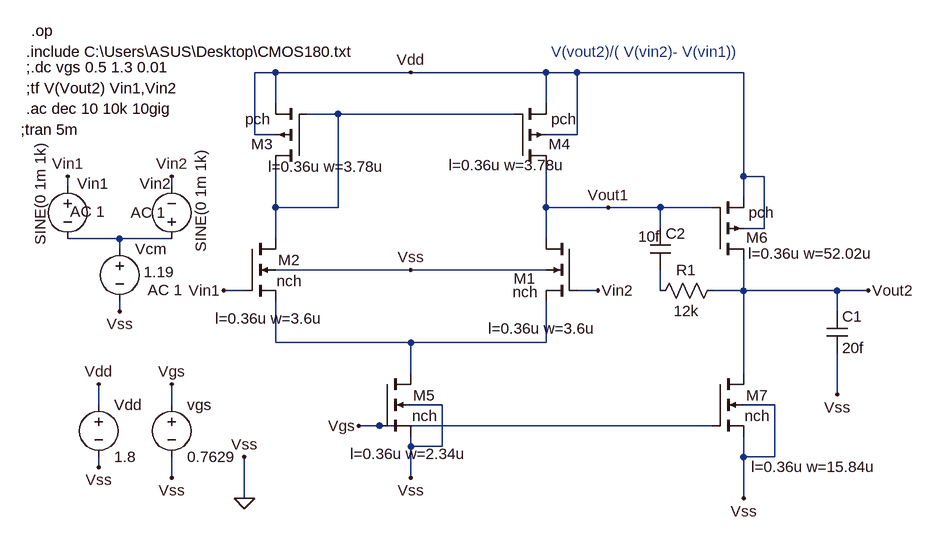
[diagram p0: schematic final design current mirror.asc]
final design current mirror.asc, the LTspice schematic file:
Version 4
SHEET 1 1412 680
WIRE 304 -160 272 -160
WIRE 512 -160 304 -160
WIRE 720 -160 512 -160
WIRE 768 -160 720 -160
WIRE 1024 -160 768 -160
WIRE 304 -112 304 -160
WIRE 720 -112 720 -160
WIRE 400 -96 352 -96
WIRE 672 -96 400 -96
WIRE 272 -64 272 -160
WIRE 304 -64 272 -64
WIRE 768 -64 768 -160
WIRE 768 -64 720 -64
WIRE 1024 0 1024 -160
WIRE 1056 0 1024 0
WIRE -16 16 -16 0
WIRE 144 16 144 0
WIRE 1024 32 1024 0
WIRE 304 48 304 -16
WIRE 400 48 400 -96
WIRE 400 48 304 48
WIRE 720 48 720 -16
WIRE 816 48 720 48
WIRE 896 48 816 48
WIRE 976 48 896 48
WIRE 896 80 896 48
WIRE 1056 80 1056 0
WIRE 1056 80 1024 80
WIRE 64 96 -16 96
WIRE 144 96 64 96
WIRE 304 96 304 48
WIRE 720 96 720 48
WIRE 64 112 64 96
WIRE 512 144 304 144
WIRE 720 144 512 144
WIRE 256 176 224 176
WIRE 800 176 768 176
WIRE 896 176 896 144
WIRE 1024 176 1024 128
WIRE 1024 176 976 176
WIRE 1168 176 1024 176
WIRE 1216 176 1168 176
WIRE 64 208 64 192
WIRE 1168 208 1168 176
WIRE 304 256 304 192
WIRE 512 256 304 256
WIRE 720 256 720 192
WIRE 720 256 512 256
WIRE 512 304 512 256
WIRE 1024 304 1024 176
WIRE 1168 336 1168 272
WIRE 32 352 32 320
WIRE 144 352 144 320
WIRE 560 352 512 352
WIRE 1072 352 1024 352
WIRE 464 384 432 384
WIRE 976 384 464 384
WIRE 512 416 512 400
WIRE 560 416 560 352
WIRE 560 416 512 416
WIRE 1024 432 1024 400
WIRE 1072 432 1072 352
WIRE 1072 432 1024 432
WIRE 32 448 32 432
WIRE 144 464 144 432
WIRE 512 464 512 416
WIRE 256 496 256 432
WIRE 1024 496 1024 432
FLAG 256 496 0
FLAG 256 432 Vss
FLAG 32 448 Vss
FLAG 64 208 Vss
FLAG 32 320 Vdd
FLAG 800 176 Vin2
FLAG 224 176 Vin1
FLAG 512 -160 Vdd
FLAG 512 144 Vss
FLAG -16 0 Vin1
FLAG 144 0 Vin2
FLAG 144 320 Vgs
FLAG 144 464 Vss
FLAG 816 48 Vout1
FLAG 432 384 Vgs
FLAG 512 464 Vss
FLAG 1216 176 Vout2
FLAG 1024 496 Vss
FLAG 1168 336 Vss
DATAFLAG 720 48 ""
DATAFLAG 720 48 ""
DATAFLAG 720 48 ""
DATAFLAG 720 48 ""
DATAFLAG 720 48 ""
DATAFLAG 720 48 ""
DATAFLAG 736 48 ""
DATAFLAG 736 48 ""
SYMBOL nmos4 768 96 M0
WINDOW 0 64 61 Left 2
WINDOW 3 60 82 Left 2
WINDOW 123 -29 138 Left 2
SYMATTR InstName M1
SYMATTR Value nch
SYMATTR Value2 l=0.36u w=3.6u
SYMBOL voltage 32 336 R0
WINDOW 123 0 0 Left 0
WINDOW 39 0 0 Left 0
SYMATTR InstName Vdd
SYMATTR Value 1.8
SYMBOL voltage 64 96 R0
WINDOW 3 37 51 Left 2
WINDOW 123 43 79 Left 2
WINDOW 39 0 0 Left 0
SYMATTR Value 1.19
SYMATTR Value2 AC 1
SYMATTR InstName Vcm
SYMBOL pmos4 672 -16 M180
WINDOW 123 -102 1 Left 2
WINDOW 0 52 34 Left 2
SYMATTR Value2 l=0.36u w=3.78u
SYMATTR InstName M4
SYMATTR Value pch
SYMBOL nmos4 256 96 R0
WINDOW 0 52 33 Left 2
WINDOW 3 50 65 Left 2
WINDOW 123 -45 123 Left 2
SYMATTR InstName M2
SYMATTR Value nch
SYMATTR Value2 l=0.36u w=3.6u
SYMBOL voltage -16 0 R0
WINDOW 0 15 11 Left 2
WINDOW 3 -42 -52 VRight 2
WINDOW 123 4 54 Left 2
WINDOW 39 0 0 Left 0
SYMATTR InstName Vin1
SYMATTR Value SINE(0 1m 1k)
SYMATTR Value2 AC 1
SYMBOL voltage 144 112 M180
WINDOW 0 -49 101 Left 2
WINDOW 3 45 153 VLeft 2
WINDOW 123 -63 56 Left 2
WINDOW 39 0 0 Left 0
SYMATTR InstName Vin2
SYMATTR Value SINE(0 1m 1k)
SYMATTR Value2 AC 1
SYMBOL voltage 144 336 R0
WINDOW 123 0 0 Left 0
WINDOW 39 0 0 Left 0
SYMATTR InstName vgs
SYMATTR Value 0.7629
SYMBOL pmos4 352 -16 R180
WINDOW 123 -120 -1 Left 2
WINDOW 0 52 34 Left 2
SYMATTR Value2 l=0.36u w=3.78u
SYMATTR InstName M3
SYMATTR Value pch
SYMBOL nmos4 464 304 R0
WINDOW 0 52 33 Left 2
WINDOW 3 50 65 Left 2
WINDOW 123 -45 123 Left 2
SYMATTR InstName M5
SYMATTR Value nch
SYMATTR Value2 l=0.36u w=2.34u
SYMBOL pmos4 976 128 M180
WINDOW 123 55 9 Left 2
WINDOW 0 52 34 Left 2
SYMATTR Value2 l=0.36u w=52.02u
SYMATTR InstName M6
SYMATTR Value pch
SYMBOL nmos4 976 304 R0
WINDOW 0 52 33 Left 2
WINDOW 3 50 65 Left 2
WINDOW 123 60 143 Left 2
SYMATTR InstName M7
SYMATTR Value nch
SYMATTR Value2 l=0.36u w=15.84u
SYMBOL cap 1152 208 R0
SYMATTR InstName C1
SYMATTR Value 20f
SYMBOL res 992 160 R90
WINDOW 0 0 56 VBottom 2
WINDOW 3 32 56 VTop 2
SYMATTR InstName R1
SYMATTR Value 12k
SYMBOL cap 880 80 R0
WINDOW 3 -18 13 Left 2
SYMATTR Value 10f
SYMATTR InstName C2
TEXT -80 -192 Left 2 !.include C:\\Users\\ASUS\\Desktop\\CMOS180.txt
TEXT -72 -224 Left 2 !.op
TEXT -80 -136 Left 2 !;tf V(Vout2) Vin1,Vin2
TEXT -80 -104 Left 2 !.ac dec 10 10k 10gig
TEXT -88 -72 Left 2 !;tran 5m
TEXT -80 -168 Left 2 !;.dc vgs 0.5 1.3 0.01
TEXT 728 -192 Left 2 ;V(vout2)/( V(vin2)- V(vin1))

The netlist it stands for:
* final design current mirror.asc
M1 Vout1 Vin2 N004 0 nch l=0.36u w=3.6u
Vdd Vdd 0 1.8
Vcm N002 0 1.19 AC 1
M4 Vout1 N001 Vdd Vdd pch l=0.36u w=3.78u
M2 N001 Vin1 N004 0 nch l=0.36u w=3.6u
Vin1 Vin1 N002 SINE(0 1m 1k) AC 1
Vin2 N002 Vin2 SINE(0 1m 1k) AC 1
vgs Vgs 0 0.7629
M3 N001 N001 Vdd Vdd pch l=0.36u w=3.78u
M5 N004 Vgs 0 0 nch l=0.36u w=2.34u
M6 Vout2 Vout1 Vdd Vdd pch l=0.36u w=52.02u
M7 Vout2 Vgs 0 0 nch l=0.36u w=15.84u
C1 Vout2 0 20f
R1 Vout2 N003 12k
C2 Vout1 N003 10f
.model NMOS NMOS
.model PMOS PMOS
.lib standard.mos
.include C:\Users\ASUS\Desktop\CMOS180.txt
.op
;tf V(Vout2) Vin1,Vin2
.ac dec 10 10k 10gig
;tran 5m
;.dc vgs 0.5 1.3 0.01
* V(vout2)/( V(vin2)- V(vin1))
.backanno
.end